# EAGLE design Rocky Switch Shield v2 (EAGLE 7.2.0)
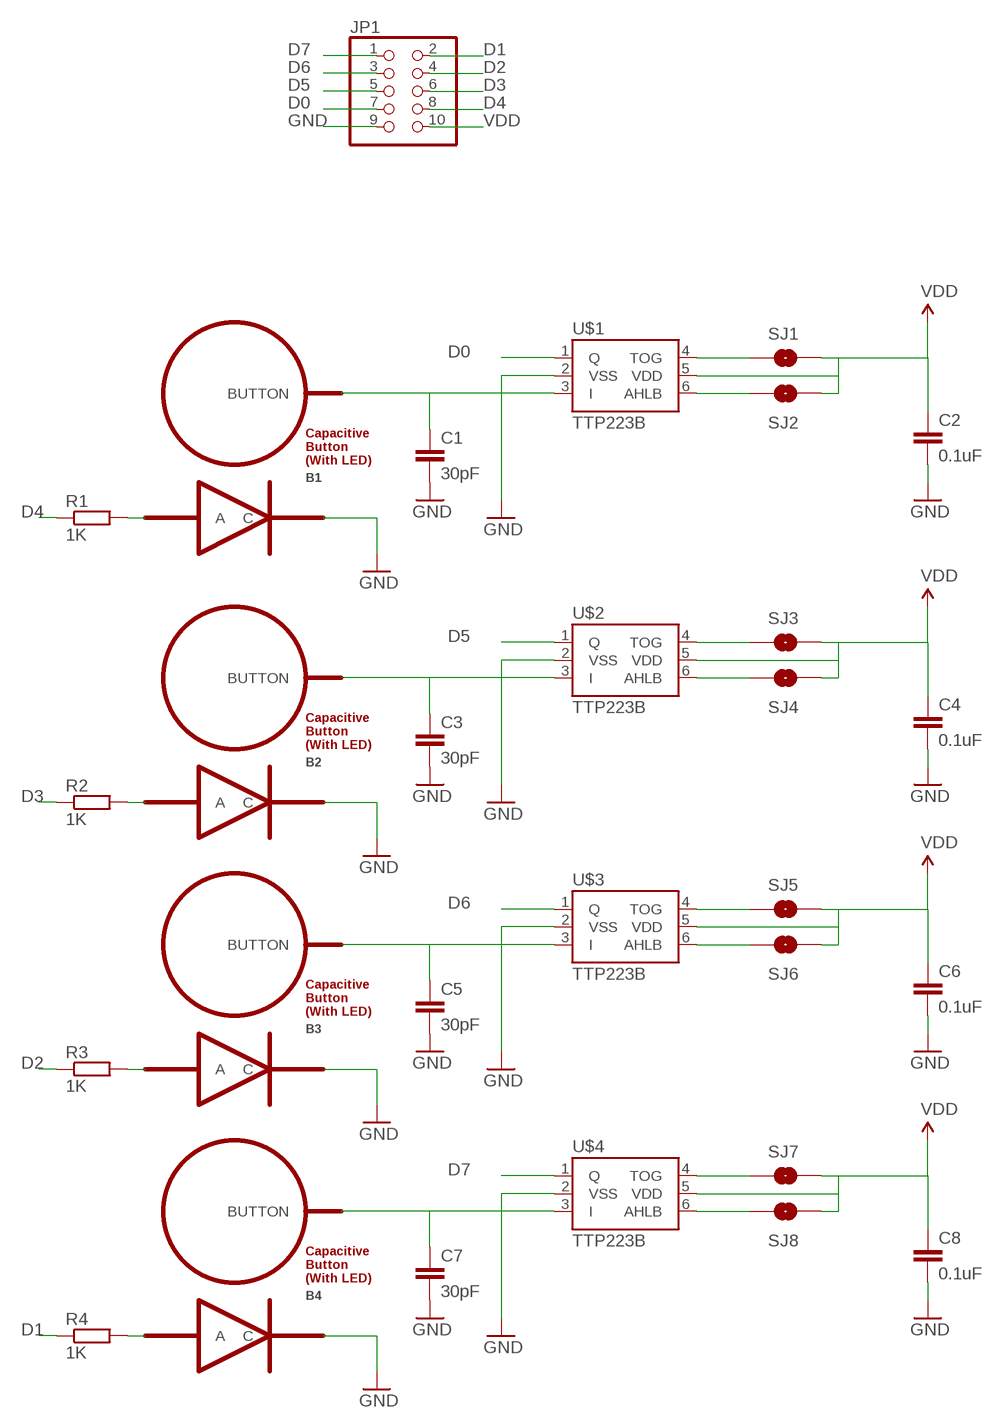
[diagram p0: schematic, sheet 1]

## Parts
B1  BUTTON_PASSIVE_LED  [BUTTON_PASSIVE_12MM_LED]
B2  BUTTON_PASSIVE_LED  [BUTTON_PASSIVE_12MM_LED]
B3  BUTTON_PASSIVE_LED  [BUTTON_PASSIVE_12MM_LED]
B4  BUTTON_PASSIVE_LED  [BUTTON_PASSIVE_12MM_LED]
C1  30pF  C-EUC0805K  [C0805K]
C2  0.1uF  C-EUC0805K  [C0805K]
C3  30pF  C-EUC0805K  [C0805K]
C4  0.1uF  C-EUC0805K  [C0805K]
C5  30pF  C-EUC0805K  [C0805K]
C6  0.1uF  C-EUC0805K  [C0805K]
C7  30pF  C-EUC0805K  [C0805K]
C8  0.1uF  C-EUC0805K  [C0805K]
JP1  PINHD-2X5  [2X05]
R1  1K  R-EU_R0805  [R0805]
R2  1K  R-EU_R0805  [R0805]
R3  1K  R-EU_R0805  [R0805]
R4  1K  R-EU_R0805  [R0805]
SJ1  JUMPER-PAD-2-NOYES_SILK  [PAD-JUMPER-2-NO_YES_SILK]
SJ2  JUMPER-PAD-2-NOYES_SILK  [PAD-JUMPER-2-NO_YES_SILK]
SJ3  JUMPER-PAD-2-NOYES_SILK  [PAD-JUMPER-2-NO_YES_SILK]
SJ4  JUMPER-PAD-2-NOYES_SILK  [PAD-JUMPER-2-NO_YES_SILK]
SJ5  JUMPER-PAD-2-NOYES_SILK  [PAD-JUMPER-2-NO_YES_SILK]
SJ6  JUMPER-PAD-2-NOYES_SILK  [PAD-JUMPER-2-NO_YES_SILK]
SJ7  JUMPER-PAD-2-NOYES_SILK  [PAD-JUMPER-2-NO_YES_SILK]
SJ8  JUMPER-PAD-2-NOYES_SILK  [PAD-JUMPER-2-NO_YES_SILK]
U$1  TTP223B  [SOT23-6]
U$2  TTP223B  [SOT23-6]
U$3  TTP223B  [SOT23-6]
U$4  TTP223B  [SOT23-6]

## Nets
D0: JP1.7 U$1.1(Q)
D1: JP1.2 R4.1
D2: JP1.4 R3.1
D3: JP1.6 R2.1
D4: JP1.8 R1.1
D5: JP1.5 U$2.1(Q)
D6: JP1.3 U$3.1(Q)
D7: JP1.1 U$4.1(Q)
GND: B1.C B2.C B3.C B4.C C1.2 C2.2 C3.2 C4.2 C5.2 C6.2 C7.2 C8.2 JP1.9 U$1.2(VSS) U$2.2(VSS) U$3.2(VSS) U$4.2(VSS)
I1: B1.BUTTON C1.1 U$1.3(I)
I2: B2.BUTTON C3.1 U$2.3(I)
I3: B3.BUTTON C5.1 U$3.3(I)
I4: B4.BUTTON C7.1 U$4.3(I)
N$1: SJ1.1 U$1.4(TOG)
N$4: B1.A R1.2
N$5: SJ2.1 U$1.6(AHLB)
N$7: SJ3.1 U$2.4(TOG)
N$8: SJ4.1 U$2.6(AHLB)
N$9: B2.A R2.2
N$11: SJ5.1 U$3.4(TOG)
N$12: SJ6.1 U$3.6(AHLB)
N$13: B3.A R3.2
N$15: SJ7.1 U$4.4(TOG)
N$16: SJ8.1 U$4.6(AHLB)
N$17: B4.A R4.2
VDD: C2.1 C4.1 C6.1 C8.1 JP1.10 SJ1.2 SJ2.2 SJ3.2 SJ4.2 SJ5.2 SJ6.2 SJ7.2 SJ8.2 U$1.5(VDD) U$2.5(VDD) U$3.5(VDD) U$4.5(VDD)

## Library data of the parts
B1-B4 = PatternAgents-TouchWidgets:BUTTON_PASSIVE_LED: Button, Passive Touch/Capacitive Sensing Type, with LED & Hole Source : http://www.PatternAgents.com Github : https://github.com/PatternAgents License : http://creativecommons.org/licenses/by-sa/3.1/ (Creative Commons 3.1) THIS SOFTWARE IS PROVIDED BY THE CONTRIBUTORS "AS IS" AND WITHOUT ANY EXPRESS OR IMPLIED WARRANTIES, INCLUDING, BUT NOT LIMITED TO, THE IMPLIED WARRANTIES OF MERCHANTABILITY AND FITNESS FOR A PARTICULAR PURPOSE ARE DISCLAIMED. IN NO EVENT SHALL THE COPYRIGHT OWNER OR CONTRIBUTORS BE LIABLE FOR ANY DIRECT, INDIRECT, INCIDENTAL, SPECIAL, EXEMPLARY, OR CONSEQUENTIAL DAMAGES (INCLUDING, BUT NOT LIMITED TO, PROCUREMENT OF SUBSTITUTE GOODS OR SERVICES; LOSS OF USE, DATA, OR PROFITS; OR BUSINESS INTERRUPTION) HOWEVER CAUSED AND ON ANY THEORY OF LIABILITY, WHETHER IN CONTRACT, STRICT LIABILITY, OR TORT (INCLUDING NEGLIGENCE OR OTHERWISE) ARISING IN ANY WAY OUT OF THE USE OF THIS SOFTWARE, EVEN IF ADVISED OF THE POSSIBILITY OF SUCH DAMAGE.
C1-C8 = rcl:C-EU: CAPACITOR, European symbol
JP1 = pinhead:PINHD-2X5: PIN HEADER
R1-R4 = rcl:R-EU_: RESISTOR, European symbol
SJ1-SJ8 = SparkFun-Passives:JUMPER-PAD-2-NO
U$1-U$4 = My Eagle Lib:TTP223B

## Board
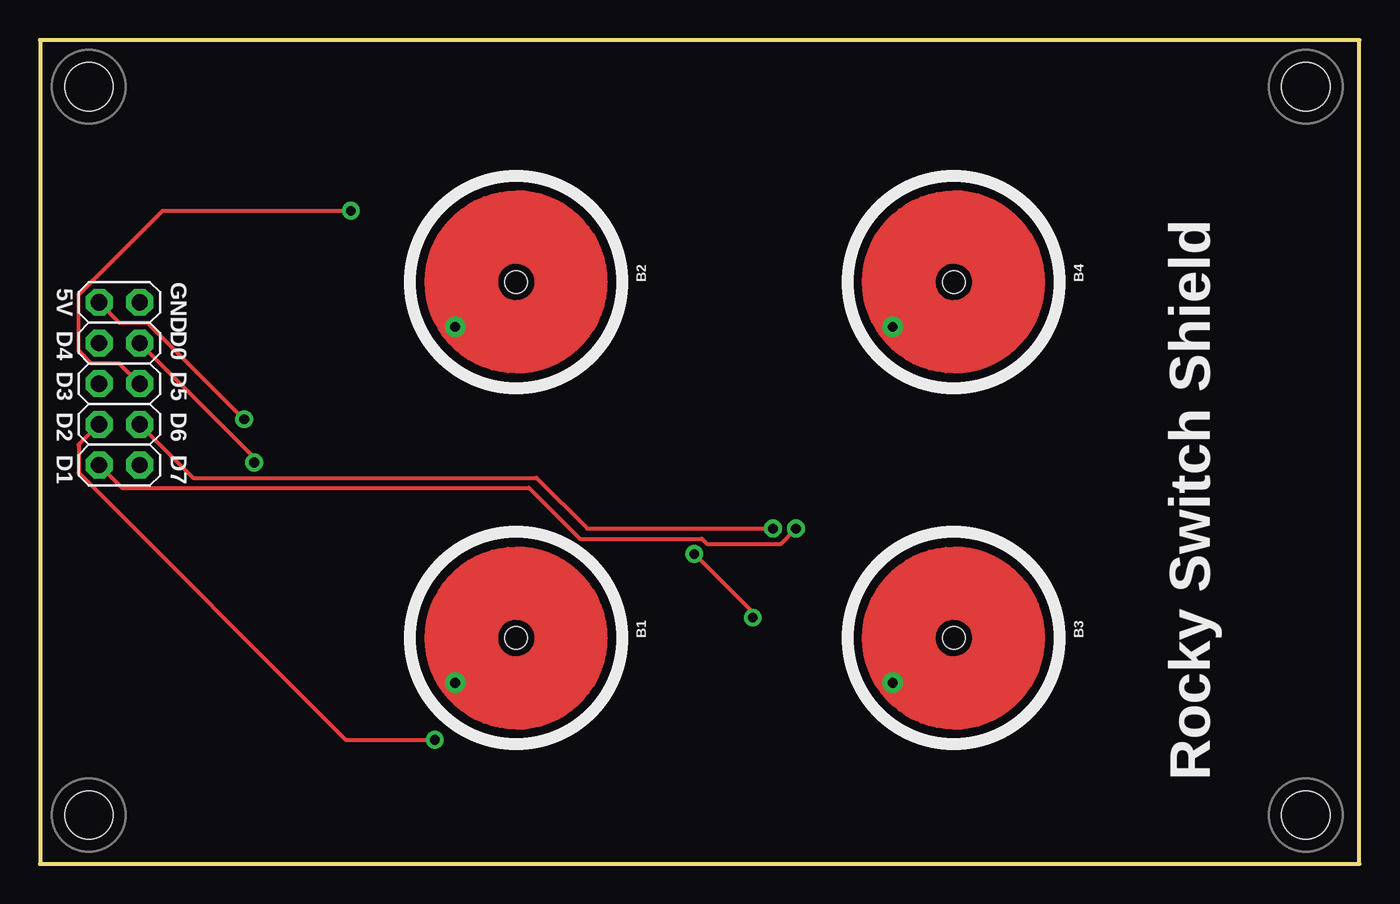
[diagram p1: board, top side]
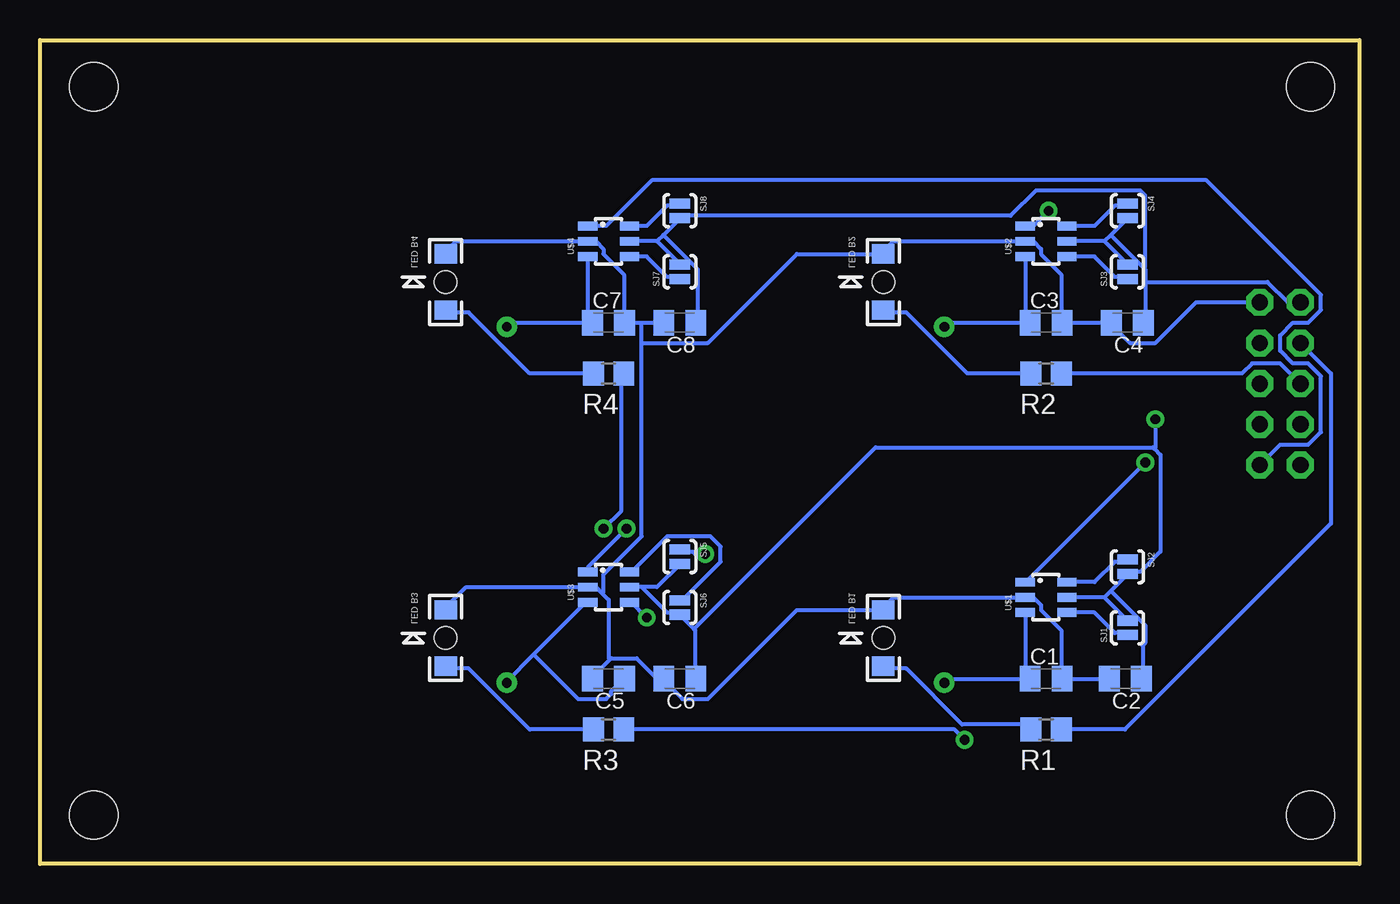
[diagram p2: board, bottom side, seen from below]

Size 82.35 x 51.43 mm. Coordinates in mm from the lower left corner, seen from the top.
Outline: 0,0 82.35,0 82.35,51.43 0,51.43 0,0
Copper layers (1*16): Top 0.035mm / dielectric 1.5mm / Bottom 0.035mm
Design rules "default *": minimum track width 10mil, minimum drill 24mil, track to track 10mil, track to pad 10mil, pad to pad 10mil, via to via 10mil, smd to smd 8mil, copper to edge 20mil, drill to drill 12mil, minimum pad ring 13mil, minimum via ring 10mil, stop-mask expansion 4mil, vias tented up to drill 0mil, thermal gap 10mil

### Footprints (pad centres in the part's own frame; a part is rotated, then mirrored left to right if it is on the bottom)
BUTTON_PASSIVE_12MM_LED = smd 1.2 x 1.4 bottom: A -1.754,0; C 1.754,0 | drill 0.61: BUTTON -2.794,3.81 | hole 1.4: 0,0
C0805K = smd 1.3 x 1.6: 1 -1,0; 2 1,0
2X05 = drill 1.016 octagon: 1 -5.08,-1.27; 2 -5.08,1.27; 3 -2.54,-1.27; 4 -2.54,1.27; 5 0,-1.27; 6 0,1.27; 7 2.54,-1.27; 8 2.54,1.27; 9 5.08,-1.27; 10 5.08,1.27
R0805 = smd 1.3 x 1.5: 1 -0.95,0; 2 0.95,0
PAD-JUMPER-2-NO_YES_SILK = smd 0.635 x 1.27: 1 -0.45,0; 2 0.45,0
SOT23-6 = smd 0.55 x 1.2: 1 0.95,1.3; 2 0,1.3; 3 -0.95,1.3; 4 -0.95,-1.3; 5 0,-1.3; 6 0.95,-1.3
KFH-M3 = hole 3: 0,0

### Placement (x,y rotation side)
B1  29.72,14.1 90 top
B2  29.72,36.32 90 top
B3  57.02,14.1 90 top
B4  57.02,36.32 90 top
C1  19.56,11.56 0 bottom
C2  14.61,11.56 180 bottom
C3  19.56,33.78 0 bottom
C4  14.48,33.78 180 bottom
C5  46.86,11.56 180 bottom
C6  42.42,11.56 180 bottom
C7  46.86,33.78 0 bottom
C8  42.42,33.78 180 bottom
JP1  4.95,29.97 90 top
R1  19.56,8.38 180 bottom
R2  19.56,30.61 180 bottom
R3  46.86,8.38 180 bottom
R4  46.86,30.61 180 bottom
SJ1  14.48,14.73 90 bottom
SJ2  14.48,18.54 270 bottom
SJ3  14.48,36.96 90 bottom
SJ4  14.48,40.77 270 bottom
SJ5  42.42,19.18 270 bottom
SJ6  42.42,16 270 bottom
SJ7  42.42,36.96 90 bottom
SJ8  42.42,40.77 270 bottom
U$1  19.56,16.64 90 bottom
U$2  19.56,38.86 90 bottom
U$3  46.86,17.27 90 bottom
U$4  46.86,38.86 90 bottom
U$6  [KFH-M3]  3.05,3.05 0 top
U$7  [KFH-M3]  78.99,3.05 0 top
U$8  [KFH-M3]  78.99,48.51 0 top
U$9  [KFH-M3]  3.05,48.51 0 top

### Tracks (layer width: path | path; a pad name or v marks a point on that pad's centre or on a via)
D0  (via drill 0.61)
  Top 0.254: v13.37,25.05 13.37,25.37 JP1.7
  Bottom 0.254: v13.37,25.05 20.83,17.59 U$1.1
D1  (via drill 0.61)
  Top 0.254: v47.18,20.92 46.23,19.97 41.62,19.97 41.31,20.29 33.69,20.29 30.51,23.46 5.11,23.46 JP1.2
  Bottom 0.254: v47.18,20.92 46.07,22.04 46.07,30.61 R4.1
D2  (via drill 0.61)
  Top 0.254: v24.64,7.75 19.08,7.75 2.41,24.42 2.41,26.16 JP1.4
  Bottom 0.254: R3.1 25.27,8.38 v24.64,7.75
D3
  Bottom 0.254: R2.1 7.33,30.61 6.7,31.24 4.95,31.24 JP1.6
D4
  Bottom 0.254: R1.1 14.64,8.38 1.78,21.24 1.78,30.61 JP1.8
D5  (via drill 0.61)
  Top 0.254: v19.4,40.77 7.65,40.77 2.41,35.53 2.41,32.04 3.21,31.24 4.95,31.24 JP1.5
  Bottom 0.254: v19.4,40.77 20.35,39.81 20.83,39.81 U$2.1
D6  (via drill 0.61)
  Top 0.254: v45.75,20.92 34.16,20.92 30.99,24.1 9.56,24.1 JP1.3
  Bottom 0.254: v45.75,20.92 48.13,18.54 48.13,18.22 U$3.1
D7
  Bottom 0.254: JP1.1 4.95,26.16 3.21,26.16 2.41,26.96 2.41,30.45 3.21,31.24 4.16,31.24 4.95,32.04 4.95,32.99 4.16,33.78 3.21,33.78 2.41,34.58 2.41,35.53 9.56,42.67 44.16,42.67 47.02,39.81 48.13,39.81 U$4.1
GND
  Bottom 0.254: 15.59,33.78 C3.2 18.61,33.78 18.61,36.8 19.88,38.07 19.88,38.39 20.35,38.86 U$2.2 29.08,38.86 29.72,38.23 B2.C 35.12,38.07 40.67,32.51 44.8,32.51 | JP1.9 10.19,35.05 12.73,32.51 14.32,32.51 15.59,33.78 | 15.59,33.78 C4.2 | C2.2 C1.2 18.61,11.56 18.61,14.57 19.88,15.84 19.88,16.16 20.35,16.64 U$1.2 29.08,16.64 29.72,16 B1.C 35.12,15.84 40.67,10.29 42.26,10.29 43.53,11.56 | 44.8,33.78 C7.2 45.91,33.78 45.91,36.8 47.18,38.07 47.18,38.39 47.66,38.86 U$4.2 56.39,38.86 57.02,38.23 B4.C | 44.8,33.78 C8.2 | 43.53,11.56 43.85,11.56 45.12,12.83 46.7,12.83 46.78,12.75 | 46.78,12.75 47.97,11.56 C5.2 | B3.C 57.02,16 55.75,17.27 U$3.2 47.66,17.27 47.26,16.88 | 47.26,16.88 46.86,16.48 46.86,12.83 46.78,12.75 | 44.8,32.51 44.8,20.45 47.18,18.07 47.18,16.95 47.26,16.88 | 44.8,32.51 44.8,33.78 | 43.53,11.56 C6.2
  pour Bottom (isolate 0.508): 86.87,55.37 96.65,55.25 96.65,-4.45 86.87,-4.32
  pour Top (isolate 0.508, no thermals): 86.87,55.37 96.65,55.25 96.65,-4.45 86.87,-4.32
I1
  Bottom 0.254: U$1.3 20.83,15.68 20.83,11.72 20.67,11.56 C1.1 25.75,11.56 25.91,11.4 B1.BUTTON
I2
  Bottom 0.254: U$2.3 20.83,37.91 20.83,33.94 20.67,33.78 C3.1 25.75,33.78 25.91,33.62 B2.BUTTON
I3
  Bottom 0.254: 51.55,13.06 53.21,11.4 B3.BUTTON | 51.55,13.06 48.29,16.32 U$3.3 | 51.55,13.06 48.77,10.29 47.02,10.29 46.7,10.61 46.7,10.76 45.91,11.56 C5.1
I4
  Bottom 0.254: U$4.3 48.13,37.91 48.13,33.94 47.97,33.78 C7.1 53.05,33.78 53.21,33.62 B4.BUTTON
N$1
  Bottom 0.254: U$1.4 18.13,15.68 16.54,15.68 15.27,14.41 14.48,14.41 SJ1.1
N$4
  Bottom 0.254: B1.A 29.72,12.19 28.29,12.19 24.8,8.7 20.83,8.7 R1.2
N$5
  Bottom 0.254: U$1.6 18.13,17.59 16.54,17.59 15.27,18.86 14.48,18.86 SJ2.1
N$7
  Bottom 0.254: U$2.4 18.13,37.91 16.54,37.91 15.27,36.64 14.48,36.64 SJ3.1
N$8
  Bottom 0.254: U$2.6 18.13,39.81 16.54,39.81 15.27,41.09 14.48,41.09 SJ4.1
N$9
  Bottom 0.254: R2.2 24.48,30.61 28.29,34.42 29.72,34.42 B2.A
N$11  (via drill 0.61)
  Top 0.254: v44.48,15.37 44.48,15.68 v40.83,19.34
  Bottom 0.254: v44.48,15.37 45.43,16.32 U$3.4 | v40.83,19.34 41.47,19.34 41.62,19.49 42.42,19.49 SJ5.1
N$12
  Bottom 0.254: U$3.6 45.43,18.22 43.21,20.45 40.51,20.45 39.88,19.81 39.88,18.86 42.42,16.32 SJ6.1
N$13
  Bottom 0.254: R3.2 51.78,8.38 55.59,12.19 57.02,12.19 B3.A
N$15
  Bottom 0.254: U$4.4 45.43,37.91 44.48,37.91 43.21,36.64 42.42,36.64 SJ7.1
N$16
  Bottom 0.254: U$4.6 45.43,39.81 44.48,39.81 43.21,41.09 42.42,41.09 SJ8.1
N$17
  Bottom 0.254: R4.2 51.78,30.61 55.59,34.42 57.02,34.42 B4.A
VDD  (via drill 0.61)
  Top 0.254: v12.73,27.75 6.7,33.78 4.95,33.78 JP1.10
  Bottom 0.254: 15.91,16.64 U$1.5 | 15.51,17.03 14.48,18.07 SJ2.2 14.48,18.22 13.68,18.22 12.41,19.49 12.41,25.53 12.81,25.92 | 15.51,17.03 15.91,16.64 | 15.91,16.64 14.48,15.21 SJ1.2 | 15.51,17.03 13.37,14.89 13.37,13.78 13.53,13.62 13.53,11.56 C2.1 | 44.8,17.27 43.85,17.27 42.42,18.7 SJ5.2 | 44.8,17.27 U$3.5 | 44.8,17.27 43.21,15.68 42.42,15.68 SJ6.2 42.42,15.53 41.55,14.65 | 41.55,14.65 41.47,14.57 41.47,11.56 C6.1 | 12.81,25.92 12.89,26 30.19,26 41.55,14.65 | 43.85,38.86 U$4.5 | 43.45,39.26 42.42,40.29 SJ8.2 42.42,40.45 21.78,40.45 20.19,42.04 13.68,42.04 13.37,41.72 13.37,37.28 13.45,37.2 | 43.45,39.26 43.85,38.86 | 43.85,38.86 42.42,37.43 SJ7.2 | 43.45,39.26 41.31,37.12 41.31,33.78 C8.1 | 15.91,38.86 U$2.5 | 15.51,39.26 14.48,40.29 SJ4.2 | 15.51,39.26 15.91,38.86 | 15.91,38.86 14.48,37.43 SJ3.2 | 13.37,36.32 13.37,37.12 13.45,37.2 | 13.37,36.32 13.37,33.78 C4.1 | 15.51,39.26 13.45,37.2 | JP1.10 4.48,35.05 5.75,36.32 13.37,36.32 | v12.73,27.75 12.73,26 12.81,25.92

### Text on the board
tNames: GND | 5V | D4 | D0 | D3 | D5 | D2 | D6 | D1 | D7 | Rocky Switch Shield